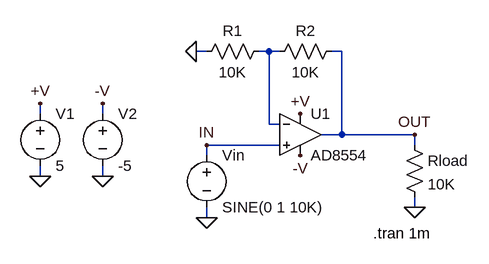
[diagram p0: schematic AD8554.asc]
AD8554.asc, the LTspice schematic file:
Version 4
SHEET 1 1240 700
WIRE 336 -1120 320 -1120
WIRE 432 -1120 416 -1120
WIRE 448 -1120 432 -1120
WIRE 544 -1120 528 -1120
WIRE 80 -1024 80 -1040
WIRE 176 -1024 176 -1040
WIRE 432 -1008 432 -1120
WIRE 448 -1008 432 -1008
WIRE 544 -992 544 -1120
WIRE 544 -992 512 -992
WIRE 656 -992 544 -992
WIRE 448 -976 336 -976
WIRE 656 -976 656 -992
WIRE 336 -960 336 -976
WIRE 80 -928 80 -944
WIRE 176 -928 176 -944
WIRE 656 -880 656 -896
WIRE 336 -864 336 -880
FLAG 80 -1040 +V
FLAG 80 -928 0
FLAG 336 -864 0
FLAG 656 -992 OUT
FLAG 336 -976 IN
FLAG 480 -1024 +V
FLAG 176 -1040 -V
FLAG 480 -960 -V
FLAG 320 -1120 0
FLAG 656 -880 0
FLAG 176 -928 0
SYMBOL Opamps\\AD8554 480 -1056 R0
SYMATTR InstName U1
SYMBOL voltage 80 -1040 R0
WINDOW 123 0 0 Left 2
WINDOW 39 0 0 Left 2
SYMATTR InstName V1
SYMATTR Value 5
SYMBOL voltage 336 -976 R0
WINDOW 123 24 146 Left 2
WINDOW 39 24 125 Left 2
SYMATTR InstName Vin
SYMATTR Value SINE(0 1 10K)
SYMBOL res 432 -1136 R90
WINDOW 0 0 56 VBottom 2
WINDOW 3 32 56 VTop 2
SYMATTR InstName R1
SYMATTR Value 10K
SYMBOL res 544 -1136 R90
WINDOW 0 0 56 VBottom 2
WINDOW 3 32 56 VTop 2
SYMATTR InstName R2
SYMATTR Value 10K
SYMBOL voltage 176 -1040 R0
WINDOW 123 24 146 Left 2
WINDOW 39 24 125 Left 2
SYMATTR InstName V2
SYMATTR Value -5
SYMBOL res 640 -992 R0
SYMATTR InstName Rload
SYMATTR Value 10K
TEXT 592 -840 Left 2 !.tran 1m

The netlist it stands for:
* AD8554.asc
XU1 IN N001 +V -V OUT AD8554  ; pins In+ In- V+ V- OUT
V1 +V 0 5
Vin IN 0 SINE(0 1 10K)
R1 N001 0 10K
R2 OUT N001 10K
V2 -V 0 -5
Rload OUT 0 10K
.tran 1m
.backanno
.end